# EAGLE schematic Mainboard (EAGLE 6.2)
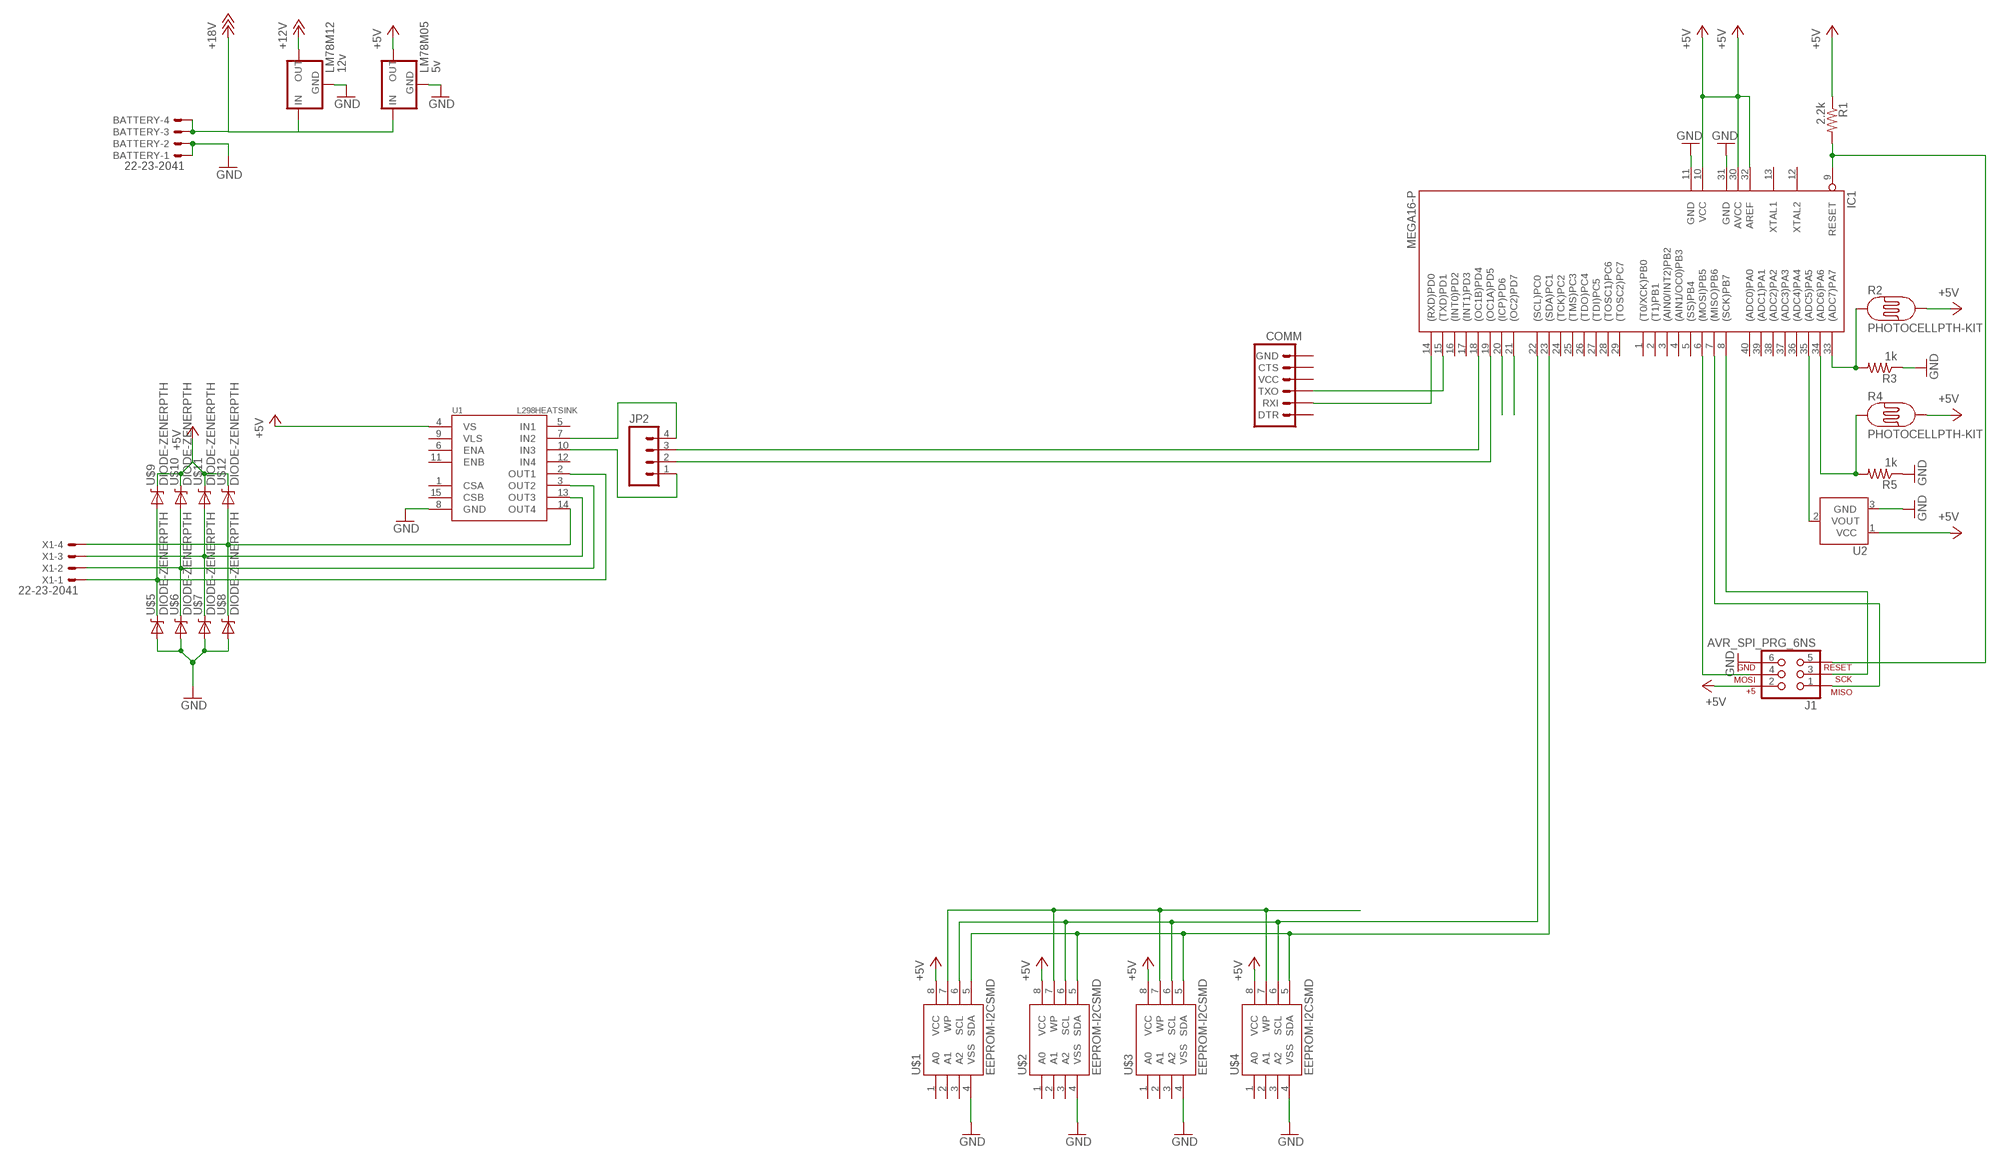
[diagram p0: schematic, sheet 1]

## Parts
BATTERY  22-23-2041  [22-23-2041]
COMM  ARDUINO_SERIAL_PROGRAMPTH  [1X06]
IC1  MEGA16-P  [DIL40]
J1  AVR_SPI_PRG_6NS  [2X3-NS]
JP2  M04PTH  [1X04]
LM78M05  5v  78MXXL  [78MXXL]
LM78M12  12v  78MXXL  [78MXXL]
R1  2.2k  RESISTORAXIAL-0.3  [AXIAL-0.3]
R2  PHOTOCELLPTH-KIT  [PHOTOCELL-KIT]
R3  1k  RESISTORKIT  [AXIAL-0.3-KIT]
R4  PHOTOCELLPTH-KIT  [PHOTOCELL-KIT]
R5  1k  RESISTORKIT  [AXIAL-0.3-KIT]
U1  L298HEATSINK  [MULTIWATT15_6400BGHEATSINK]
U2  TMP36TO-92-KIT  [TO-92-KIT]
U$1  EEPROM-I2CSMD  [SO08]
U$2  EEPROM-I2CSMD  [SO08]
U$3  EEPROM-I2CSMD  [SO08]
U$4  EEPROM-I2CSMD  [SO08]
U$5  DIODE-ZENERPTH  [DIODE-ZENER]
U$6  DIODE-ZENERPTH  [DIODE-ZENER]
U$7  DIODE-ZENERPTH  [DIODE-ZENER]
U$8  DIODE-ZENERPTH  [DIODE-ZENER]
U$9  DIODE-ZENERPTH  [DIODE-ZENER]
U$10  DIODE-ZENERPTH  [DIODE-ZENER]
U$11  DIODE-ZENERPTH  [DIODE-ZENER]
U$12  DIODE-ZENERPTH  [DIODE-ZENER]
X1  22-23-2041  [22-23-2041]

## Nets
+5V: IC1.10(VCC) IC1.30(AVCC) IC1.32(AREF) J1.2 LM78M05.OUT R1.P$1 R2.2 R4.2 U1.4(VS) U2.1(VCC) U$1.8(VCC) U$2.8(VCC) U$3.8(VCC) U$4.8(VCC) U$9.P$1(C) U$10.P$1(C) U$11.P$1(C) U$12.P$1(C)
+12V: LM78M12.OUT
+18V: BATTERY.3 BATTERY.4 LM78M05.IN LM78M12.IN
GND: BATTERY.1 BATTERY.2 IC1.11(GND) IC1.31(GND) J1.6 LM78M05.GND LM78M12.GND R3.P$1 R5.P$1 U1.8(GND) U2.3(GND) U$1.4(VSS) U$2.4(VSS) U$3.4(VSS) U$4.4(VSS) U$5.P$2(A) U$6.P$2(A) U$7.P$2(A) U$8.P$2(A)
MOTOR_A: JP2.4 U1.7(IN2)
N$1: IC1.9(RESET) J1.5 R1.P$2
N$2: IC1.23((SDA)PC1) U$1.5(SDA) U$2.5(SDA) U$3.5(SDA) U$4.5(SDA)
N$3: IC1.22((SCL)PC0) U$1.6(SCL) U$2.6(SCL) U$3.6(SCL) U$4.6(SCL)
N$4: U$1.7(WP) U$2.7(WP) U$3.7(WP) U$4.7(WP)
N$5: IC1.6((MOSI)PB5) J1.4
N$6: IC1.34((ADC6)PA6) R4.1 R5.P$2
N$7: IC1.7((MISO)PB6) J1.1
N$8: IC1.33((ADC7)PA7) R2.1 R3.P$2
N$9: IC1.8((SCK)PB7) J1.3
N$10: IC1.35((ADC5)PA5) U2.2(VOUT)
N$11: IC1.21((OC2)PD7)
N$12: IC1.20((ICP)PD6)
N$13: IC1.19((OC1A)PD5) JP2.2
N$14: IC1.18((OC1B)PD4) JP2.3
N$15: COMM.2(RXI) IC1.14((RXD)PD0)
N$16: COMM.3(TXO) IC1.15((TXD)PD1)
N$18: JP2.1 U1.10(IN3)
N$19: U1.14(OUT4) U$8.P$1(C) U$12.P$2(A) X1.4
N$21: U1.3(OUT2) U$6.P$1(C) U$10.P$2(A) X1.2
N$22: U1.2(OUT1) U$5.P$1(C) U$9.P$2(A) X1.1
N$23: U1.13(OUT3) U$7.P$1(C) U$11.P$2(A) X1.3
Unconnected: COMM.1(DTR) COMM.4(VCC) COMM.5(CTS) COMM.6(GND) IC1.1((T0/XCK)PB0) IC1.2((T1)PB1) IC1.3((AIN0/INT2)PB2) IC1.4((AIN1/OC0)PB3) IC1.5((SS)PB4) IC1.12(XTAL2) IC1.13(XTAL1) IC1.16((INT0)PD2) IC1.17((INT1)PD3) IC1.24((TCK)PC2) IC1.25((TMS)PC3) IC1.26((TDO)PC4) IC1.27((TDI)PC5) IC1.28((TOSC1)PC6) IC1.29((TOSC2)PC7) IC1.36((ADC4)PA4) IC1.37((ADC3)PA3) IC1.38((ADC2)PA2) IC1.39((ADC1)PA1) IC1.40((ADC0)PA0) U1.1(CSA) U1.5(IN1) U1.6(ENA) U1.9(VLS) U1.11(ENB) U1.12(IN4) U1.15(CSB) U$1.1(A0) U$1.2(A1) U$1.3(A2) U$2.1(A0) U$2.2(A1) U$2.3(A2) U$3.1(A0) U$3.2(A1) U$3.3(A2) U$4.1(A0) U$4.2(A1) U$4.3(A2)

## Library data of the parts
BATTERY X1 = con-molex:22-23-2041: .100" (2.54mm) Center Header - 4 Pin; MF: MOLEX; MPN: 22-23-2041; OC_FARNELL: 1462920; OC_NEWARK: 38C0355
COMM = SparkFun-Connectors:ARDUINO_SERIAL_PROGRAM: FTDI connector footprints
IC1 = atmel:MEGA16-P: MICROCONTROLLER 16 Kbytes FLASH 1 kbytes SRAM 512 bytes EEPROM USART 8-channel 10 bit ADC Source: avr.lbr; MPN: ATMEGA16-16PU; OC_FARNELL: 9171142; OC_NEWARK: 01M6885
J1 = SparkFun-Connectors:AVR_SPI_PRG_6: AVR ISP 6 Pin This is the reduced ISP connector for AVR programming. Common on Arduino. This footprint will take up less PCB space and can be used with a 10-pin to 6-pin adapter such as SKU: BOB-08508
JP2 = SparkFun-Connectors:M04: Header 4 Standard 4-pin 0.1" header. Use with straight break away headers (SKU : PRT-00116), right angle break away headers (PRT-00553), swiss pins (PRT-00743), machine pins (PRT-00117), and female headers (PRT-00115). Molex polarized connector foot print use with SKU : PRT-08231 with associated crimp pins and housings. 1MM SMD Version SKU: PRT-10208
LM78M05 LM78M12 = v-reg:78MXXL: VOLTAGE REGULATOR
R1 R3 R5 = SparkFun-Passives:RESISTOR: Resistor Basic schematic elements and footprints for 0603, 1206, and PTH resistors.
R2 R4 = SparkFun-Sensors:PHOTOCELL: CdS photoresistor. This is a low cost way to detect light levels. Resistance decreases with more incoming light. SparkFun SKU: SEN-09088
U1 = SparkFun-PowerIC:L298: L298 Dual Full Bridge Driver
U2 = SparkFun-Sensors:TMP36: Precision degC temp sensor, analog out
U$1-U$4 = SparkFun-DigitalIC:EEPROM-I2C: I2C EEPROM chips, 24LC256 (and others)
U$5-U$12 = SparkFun-DiscreteSemi:DIODE-ZENER: Zener Diode Production Part - 8199 3.4V Zener Voltage